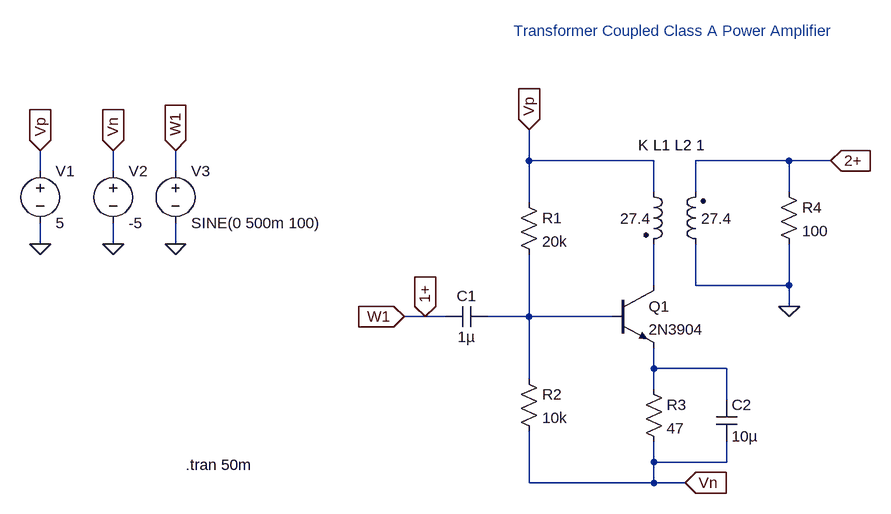
[diagram p0: schematic trans_coupled_amp_ltspice.asc]
trans_coupled_amp_ltspice.asc, the LTspice schematic file:
Version 4
SHEET 1 2132 680
WIRE 768 -144 768 -192
WIRE 960 -144 768 -144
WIRE 1168 -144 1024 -144
WIRE 1232 -144 1168 -144
WIRE 16 -128 16 -160
WIRE 128 -128 128 -160
WIRE 224 -128 224 -160
WIRE 960 -96 960 -144
WIRE 1024 -96 1024 -144
WIRE 1168 -96 1168 -144
WIRE 768 -80 768 -144
WIRE 16 -16 16 -48
WIRE 128 -16 128 -48
WIRE 224 -16 224 -48
WIRE 960 48 960 -16
WIRE 1024 48 1024 -16
WIRE 1168 48 1168 -16
WIRE 1168 48 1024 48
WIRE 1168 80 1168 48
WIRE 608 96 576 96
WIRE 640 96 608 96
WIRE 768 96 768 0
WIRE 768 96 704 96
WIRE 896 96 768 96
WIRE 960 176 960 144
WIRE 1072 176 960 176
WIRE 768 192 768 96
WIRE 960 208 960 176
WIRE 1072 224 1072 176
WIRE 960 320 960 288
WIRE 1072 320 1072 288
WIRE 1072 320 960 320
WIRE 768 352 768 272
WIRE 960 352 960 320
WIRE 960 352 768 352
WIRE 1008 352 960 352
FLAG 768 -192 Vp
IOPIN 768 -192 In
FLAG 1008 352 Vn
IOPIN 1008 352 In
FLAG 16 -16 0
FLAG 128 -16 0
FLAG 224 -16 0
FLAG 16 -160 Vp
IOPIN 16 -160 In
FLAG 128 -160 Vn
IOPIN 128 -160 In
FLAG 224 -160 W1
IOPIN 224 -160 In
FLAG 576 96 W1
IOPIN 576 96 In
FLAG 1168 80 0
FLAG 1232 -144 2+
IOPIN 1232 -144 In
FLAG 608 96 1+
IOPIN 608 96 In
SYMBOL res 752 -96 R0
SYMATTR InstName R1
SYMATTR Value 20k
SYMBOL npn 896 48 R0
SYMATTR InstName Q1
SYMATTR Value 2N3904
SYMBOL voltage 16 -144 R0
WINDOW 123 0 0 Left 0
WINDOW 39 0 0 Left 0
SYMATTR InstName V1
SYMATTR Value 5
SYMBOL voltage 128 -144 R0
WINDOW 123 0 0 Left 0
WINDOW 39 0 0 Left 0
SYMATTR InstName V2
SYMATTR Value -5
SYMBOL voltage 224 -144 R0
WINDOW 123 0 0 Left 0
WINDOW 39 0 0 Left 0
SYMATTR InstName V3
SYMATTR Value SINE(0 500m 100)
SYMBOL res 752 176 R0
SYMATTR InstName R2
SYMATTR Value 10k
SYMBOL res 944 192 R0
SYMATTR InstName R3
SYMATTR Value 47
SYMBOL cap 1056 224 R0
SYMATTR InstName C2
SYMATTR Value 10µ
SYMBOL cap 704 80 R90
WINDOW 0 0 32 VBottom 2
WINDOW 3 32 32 VTop 2
SYMATTR InstName C1
SYMATTR Value 1µ
SYMBOL ind2 944 -112 R0
WINDOW 0 -20 5 Invisible 2
WINDOW 3 -36 57 Left 2
SYMATTR InstName L1
SYMATTR Value 27.4
SYMATTR Type ind
SYMBOL ind2 1040 0 R180
WINDOW 0 -20 105 Invisible 2
WINDOW 3 7 55 Right 2
SYMATTR InstName L2
SYMATTR Value 27.4
SYMATTR Type ind
SYMBOL res 1152 -112 R0
SYMATTR InstName R4
SYMATTR Value 100
TEXT 240 324 Left 2 !.tran 50m
TEXT 936 -168 Left 2 !K L1 L2 1
TEXT 744 -344 Left 2 ;Transformer Coupled Class A Power Amplifier

The netlist it stands for:
* trans_coupled_amp_ltspice.asc
R1 Vp N002 20k
Q1 N001 N002 N003 0 2N3904
V1 Vp 0 5
V2 Vn 0 -5
V3 1+ 0 SINE(0 500m 100)
R2 N002 Vn 10k
R3 N003 Vn 47
C2 N003 Vn 10µ
C1 N002 1+ 1µ
L1 Vp N001 27.4
L2 0 2+ 27.4
R4 2+ 0 100
.model NPN NPN
.model PNP PNP
.lib standard.bjt
.tran 50m
K L1 L2 1
* Transformer Coupled Class A Power Amplifier
.backanno
.end